# Altium schematic sheet PSM_components.SchDoc
size A3; DrawnBy: Philip Rowse
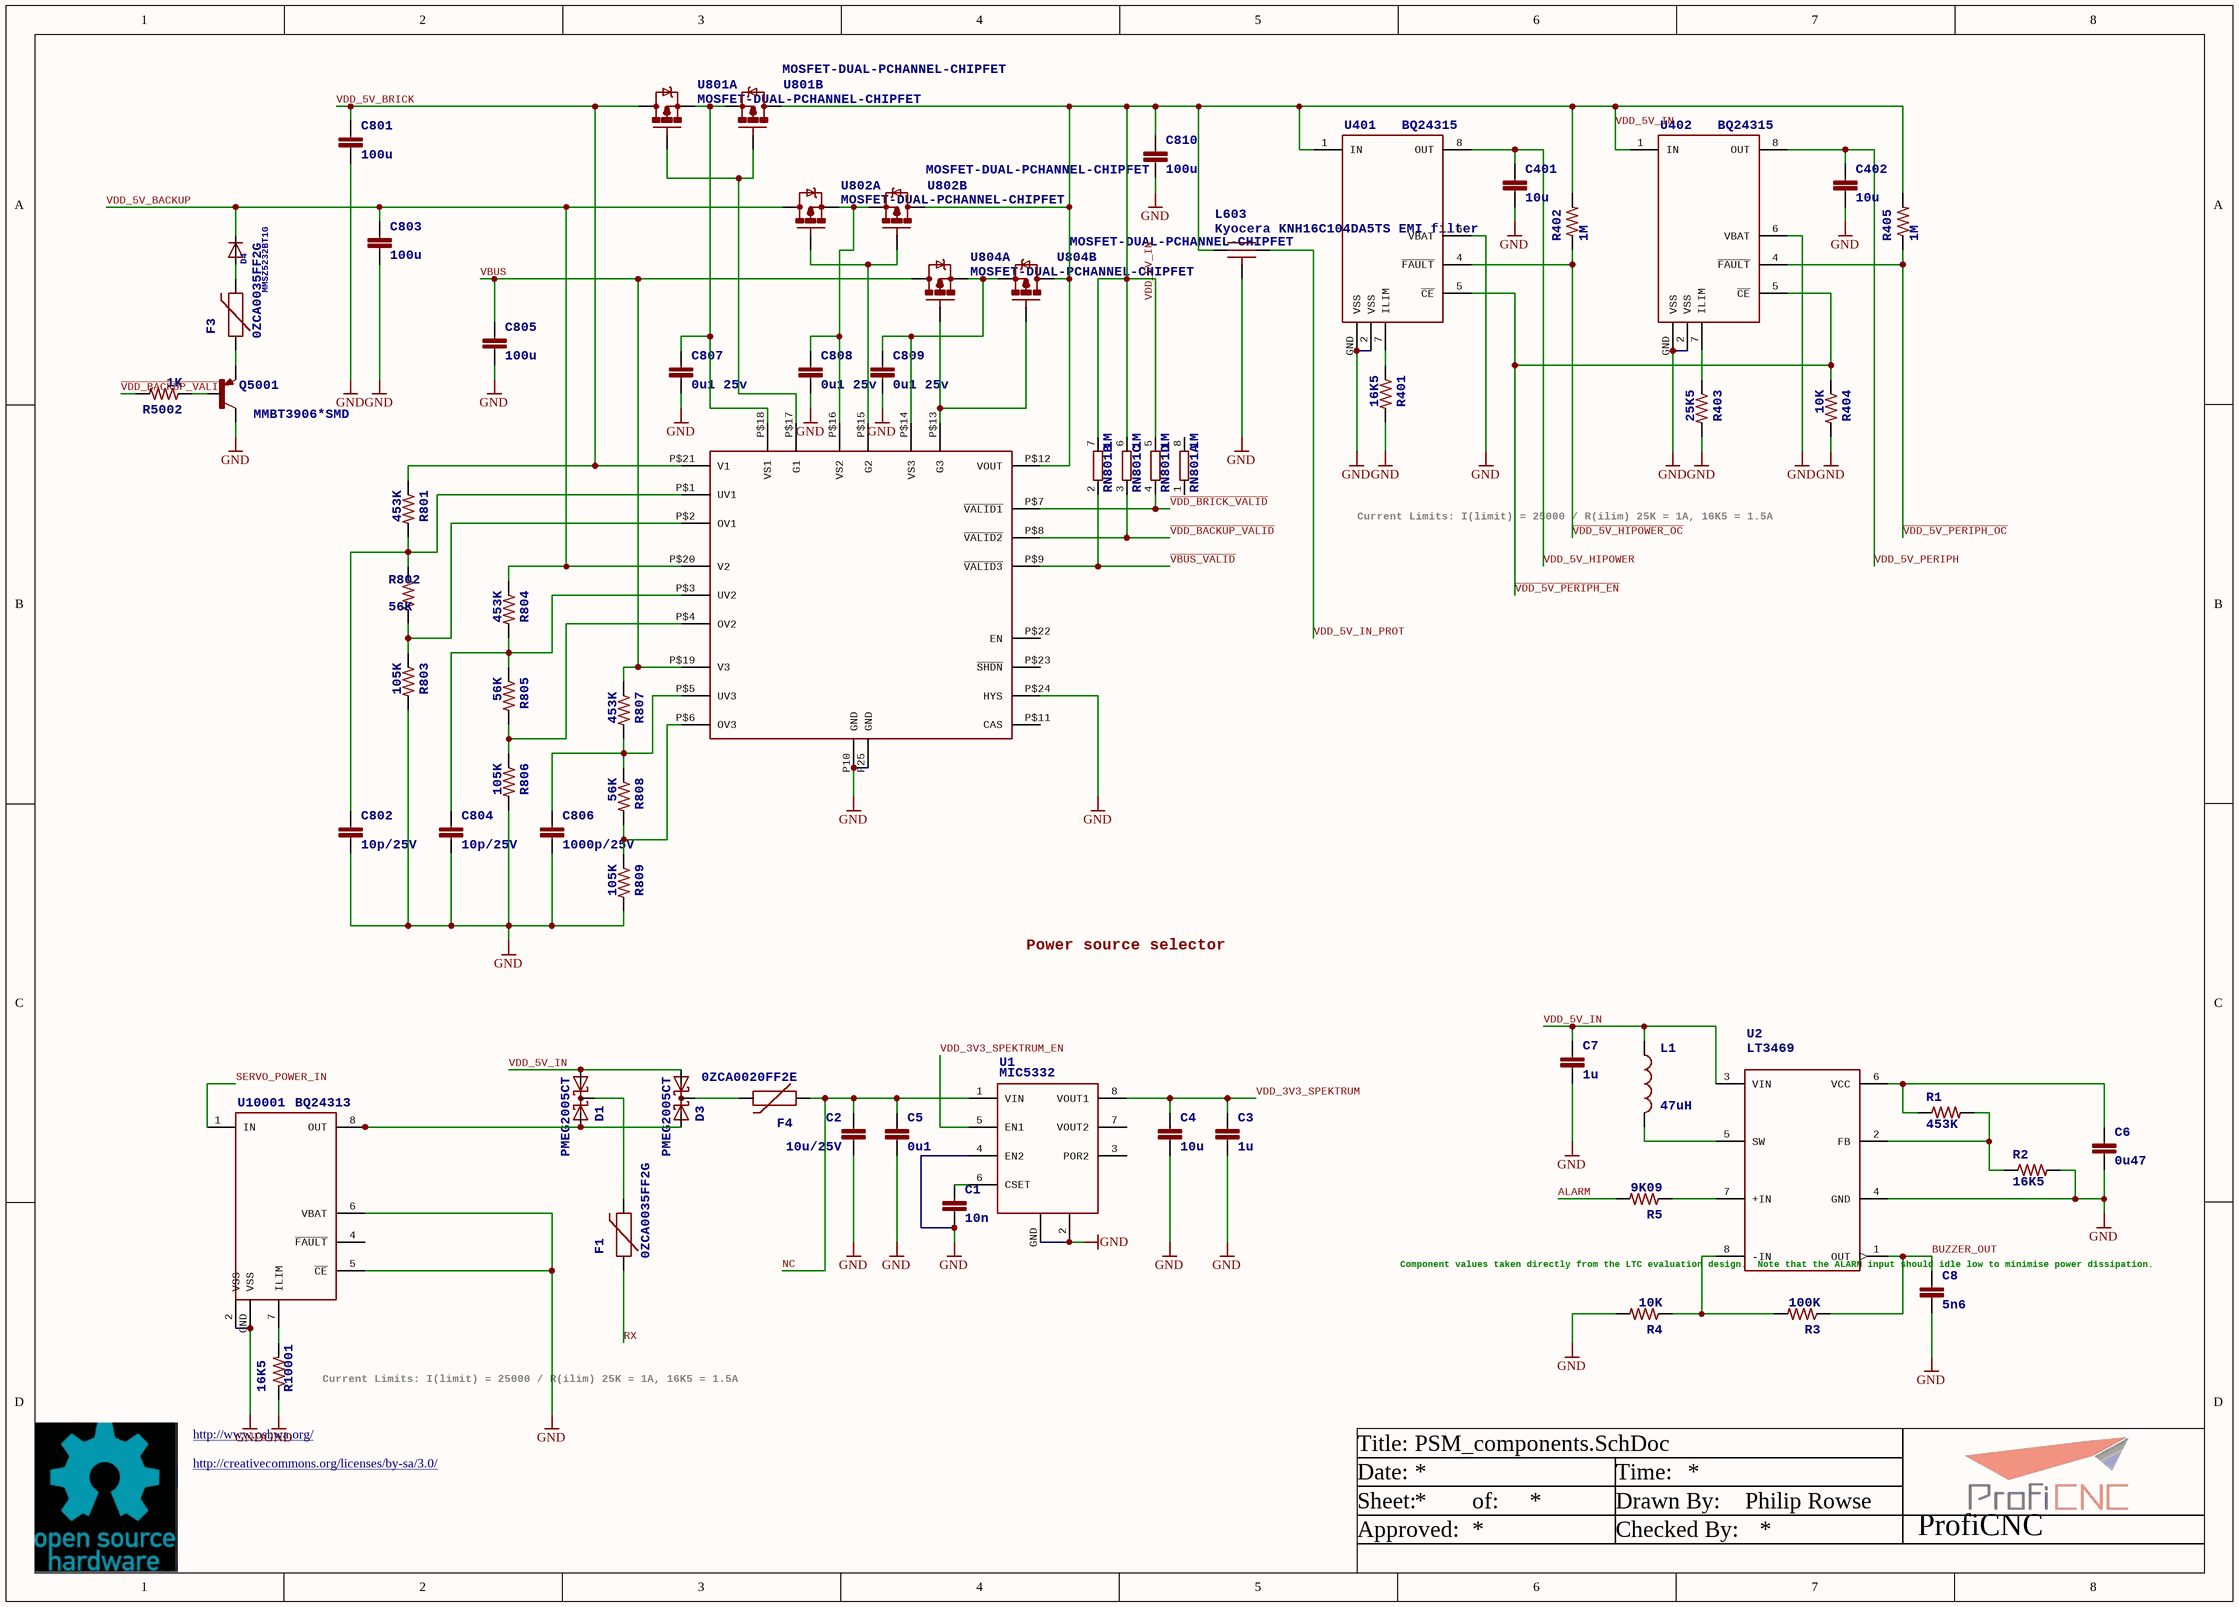
[diagram p0: PSM_components.SchDoc]

## Parts
C1  10n  [0402-CAP]
C2  10u/25V  [0805-CAP]
C3  1u  [0603-CAP]
C4  10u  [0603-CAP]
C5  0u1  [0402-CAP]
C6  0u47  [0402-CAP]
C7  1u  [0603-CAP]
C8  5n6  [0402-CAP]
C401  10u  [0603-CAP]
C402  10u  [0603-CAP]
C801  100u  [1206-CAP]
C802  10p/25V  [0402-CAP]
C803  100u  [1206-CAP]
C804  10p/25V  [0402-CAP]
C805  100u  [1206-CAP]
C806  1000p/25V  [0402-CAP]
C807  0u1 25v  [0402-CAP]
C808  0u1 25v  [0402-CAP]
C809  0u1 25v  [0402-CAP]
C810  100u  [1206-CAP]
D1  PMEG2005CT  [SOT23-3]
D3  PMEG2005CT  [SOT23-3]
D4  MMSZ5232BT1G  [SOD-123]
F1  0ZCA0035FF2G  [PTC-1206]
F3  0ZCA0035FF2G  [PTC-1206]
F4  0ZCA0020FF2E  [PTC-1206]
L1  47uH  [0805-IND]
L603  Kyocera KNH16C104DA5TS EMI filter  [KYOCERA-KNH16-DA]
Q5001  MMBT3906*SMD  [SOT23-BEC]
R1  453K  [0402-RES]
R2  16K5  [0402-RES]
R3  100K  [0402-RES]
R4  10K  [0402-RES]
R5  9K09  [0402-RES]
R401  16K5  [0402-RES]
R402  1M  [0402-RES]
R403  25K5  [0402-RES]
R404  10K  [0402-RES]
R405  1M  [0402-RES]
R801  453K  [0402-RES]
R802  56K  [0402-RES]
R803  105K  [0402-RES]
R804  453K  [0402-RES]
R805  56K  [0402-RES]
R806  105K  [0402-RES]
R807  453K  [0402-RES]
R808  56K  [0402-RES]
R809  105K  [0402-RES]
R5002  1K  [0402-RES]
R10001  16K5  [0402-RES]
RN801  1M  [EXB28V]  (parts A,B,C,D of 4)
U1  MIC5332  [MLF-8-EPAD]
U2  LT3469  [SOT23-8]
U401  BQ24315  [QFN8-DSG]
U402  BQ24315  [QFN8-DSG]
U801  MOSFET-DUAL-PCHANNEL-CHIPFET  [1206-8]  (parts A,B of 2)
U802  MOSFET-DUAL-PCHANNEL-CHIPFET  [1206-8]  (parts A,B of 2)
U803  LTC4417  [MO-220]  (value not drawn)
U804  MOSFET-DUAL-PCHANNEL-CHIPFET  [1206-8]  (parts A,B of 2)
U10001  BQ24313  [QFN8-DSG]

## Nets
GND: C1.P$2 C2.P$2 C3.P$2 C4.P$2 C5.P$2 C6.P$2 C7.P$2 C8.P$2 C401.P$2 C402.P$2 C801.P$2 C802.P$2 C803.P$2 C804.P$2 C805.P$2 C806.P$2 C807.P$2 C808.P$2 C809.P$2 C810.P$2 L603.GND Q5001.C R2.P$2 R4.P$2 R401.P$2 R403.P$2 R404.P$2 R803.P$2 R806.P$2 R809.P$2 R10001.P$1 U1.2(GND) U1.4(EN2) U1.GND U2.4(GND) U401.2(VSS) U401.6(VBAT) U401.GND(VSS) U402.2(VSS) U402.6(VBAT) U402.GND(VSS) U803.P10(GND) U803.P25(GND) U803.P$24(HYS) U10001.2(VSS) U10001.5(~{CE}) U10001.6(VBAT) U10001.GND(VSS)
ALARM: R5.P$2
BUZZER_OUT: C8.P$1 R3.P$1 U2.1(OUT)
NC: C2.P$1 C5.P$1 F4.1 U1.1(VIN)
RX: F1.1
SERVO_POWER_IN: U10001.1(IN)
~{VBUS_VALID}: RN801.2 U803.P$9(~{VALID3})
~{VDD_5V_HIPOWER_OC}: R402.P$1 U401.4(~{FAULT})
~{VDD_5V_PERIPH_EN}: R404.P$1 U401.5(~{CE}) U402.5(~{CE})
~{VDD_5V_PERIPH_OC}: R405.P$1 U402.4(~{FAULT})
~{VDD_BACKUP_VALID}: R5002.P$2 RN801.3 U803.P$8(~{VALID2})
~{VDD_BRICK_VALID}: RN801.4 U803.P$7(~{VALID1})
VBUS: C805.P$1 R807.P$1 U803.P$19(V3) U804.P7(D)
VDD_3V3_SPEKTRUM: C3.P$1 C4.P$1 U1.8(VOUT1)
VDD_3V3_SPEKTRUM_EN: U1.5(EN1)
VDD_5V_BACKUP: C803.P$1 D4.C R804.P$1 U802.P7(D) U803.P$20(V2)
VDD_5V_BRICK: C801.P$1 R801.P$1 U801.P7(D) U803.P$21(V1)
VDD_5V_HIPOWER: C401.P$1 U401.8(OUT)
VDD_5V_IN: C7.P$1 C810.P$1 D1.1(A1) D3.1(A1) L1.P$1 L603.P$1 R402.P$2 R405.P$2 RN801.5 RN801.6 RN801.7 U2.3(VIN) U401.1(IN) U402.1(IN) U801.P5(D) U802.P5(D) U803.P$12(VOUT) U804.P5(D)
VDD_5V_IN_PROT: L603.P$2
VDD_5V_PERIPH: C402.P$1 U402.8(OUT)
NetC1_P$1: C1.P$1 U1.6(CSET)
NetC6_P$1: C6.P$1 R1.P$1 U2.6(VCC)
NetC802_P$1: C802.P$1 R801.P$2 R802.P$1 U803.P$1(UV1)
NetC804_P$1: C804.P$1 R804.P$2 R805.P$1 U803.P$3(UV2)
NetC806_P$1: C806.P$1 R807.P$2 R808.P$1 U803.P$5(UV3)
NetC807_P$1: C807.P$1 U801.P1(S) U801.P3(S) U803.P$18(VS1)
NetC808_P$1: C808.P$1 U802.P1(S) U802.P3(S) U803.P$16(VS2)
NetC809_P$1: C809.P$1 U803.P$14(VS3) U804.P1(S) U804.P3(S)
NetD1_2: D1.2(A2) D3.2(A2) U10001.8(OUT)
NetD1_3: D1.3(CC) F1.2
NetD3_3: D3.3(CC) F4.2
NetD4_A: D4.A F3.2
NetF3_1: F3.1 Q5001.E
NetL1_P$2: L1.P$2 U2.5(SW)
NetQ5001_B: Q5001.B R5002.P$1
NetR1_P$2: R1.P$2 R2.P$1 U2.2(FB)
NetR3_P$2: R3.P$2 R4.P$1 U2.8(-IN)
NetR5_P$1: R5.P$1 U2.7(+IN)
NetR401_P$1: R401.P$1 U401.7(ILIM)
NetR403_P$1: R403.P$1 U402.7(ILIM)
NetR802_P$2: R802.P$2 R803.P$1 U803.P$2(OV1)
NetR805_P$2: R805.P$2 R806.P$1 U803.P$4(OV2)
NetR808_P$2: R808.P$2 R809.P$1 U803.P$6(OV3)
NetR10001_P$2: R10001.P$2 U10001.7(ILIM)
NetU801_P2: U801.P2(G) U801.P4(G) U803.P$17(G1)
NetU802_P2: U802.P2(G) U802.P4(G) U803.P$15(G2)
NetU803_P$13: U803.P$13(G3) U804.P2(G) U804.P4(G)

Not connected (* = marked no-connect by the designer): RN801 1 8(2); U1 3(POR2) 7(VOUT2); U803 P$11(CAS) P$22(EN) P$23(~{SHDN}); U10001 4(~{FAULT})

## Notes on the sheet
- Current Limits:
  I(limit) = 25000 / R(ilim)
  25K = 1A, 16K5 = 1.5A
- Power source selector
- (near U2) Component values taken directly from
  the LTC evaluation design.
  Note that the ALARM input should idle
  low to minimise power dissipation.
- (near R10001) Current Limits:
  I(limit) = 25000 / R(ilim)
  25K = 1A, 16K5 = 1.5A
- http://www.oshwa.org/
- http://creativecommons.org/licenses/by-sa/3.0/
- Title:
- Date:
- Time:
- Sheet:
- Approved:
- of:
- Drawn By:
- Checked By:
- ProfiCNC

## Library data of the parts
C1 C5 C6 C8 C802 C804 C806-C809 = CAP0402
C2 = CAP0805
C3 C4 C7 C401 C402 = CAP0603
C801 C803 C805 C810 = CAP1206
D4 = DIODESOD-123
F1 F3 F4 = PTCSMD
L1 = INDUCTOR0805
L603 = KNH16C104DA5TS
R1-R5 R401-R405 R801 R803-R809 R5002 R10001 = RESISTOR0402-RES
R802 = RESISTOR0402-RES_1
RN801 = 4R-NEXB28V
U801 U802 U804 = MOSFET-DUAL-PCHANNEL-CHIPFET: MOSFET 2P-CH 20V 2.9A CHIPFET
U803 = LTC4117